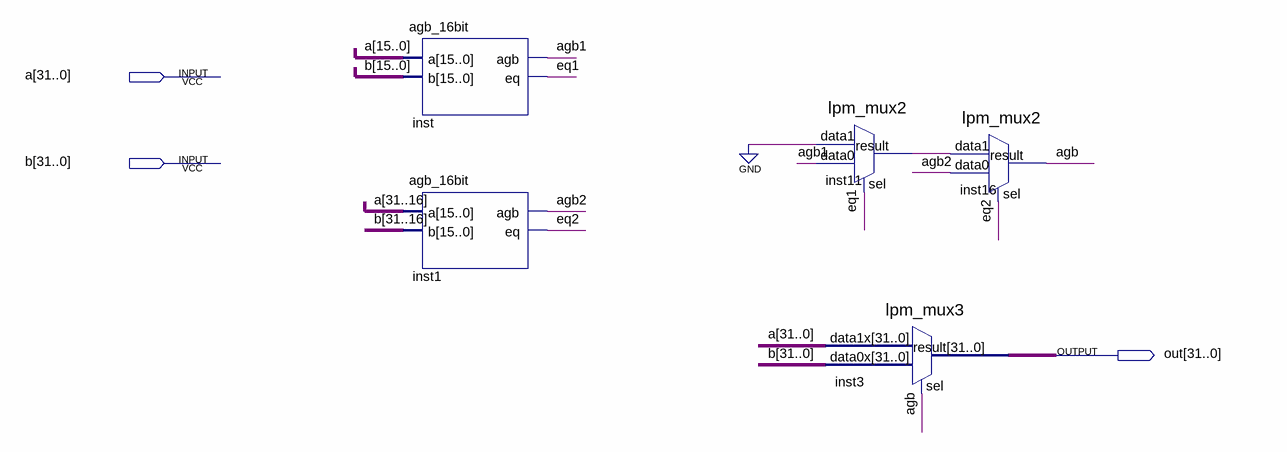
[diagram p0: schematic sheet]
// Quartus schematic agb_32bit.bdf as structural Verilog: 5 symbols, 3 pins
module agb_32bit (
  input  [31:0] a,
  input  [31:0] b,
  output [31:0] out
);

  wire agb, agb1, agb2, eq1, eq2, inst11_result;

  agb_16bit inst (.a(a[15:0]), .b(b[15:0]), .agb(agb1), .eq(eq1));
  agb_16bit inst1 (.a(a[31:16]), .b(b[31:16]), .agb(agb2), .eq(eq2));
  lpm_mux2 inst11 (.data1(1'b0), .data0(agb1), .sel(eq1), .result(inst11_result));
  lpm_mux3 inst3 (.data1x(a), .data0x(b), .sel(agb), .result(out));
  lpm_mux2 inst16 (.data1(inst11_result), .data0(agb2), .sel(eq2), .result(agb));
endmodule
